# EAGLE design mapleCUx_large_067 (EAGLE 7.3.0)
MAPLE-CUx Large Version
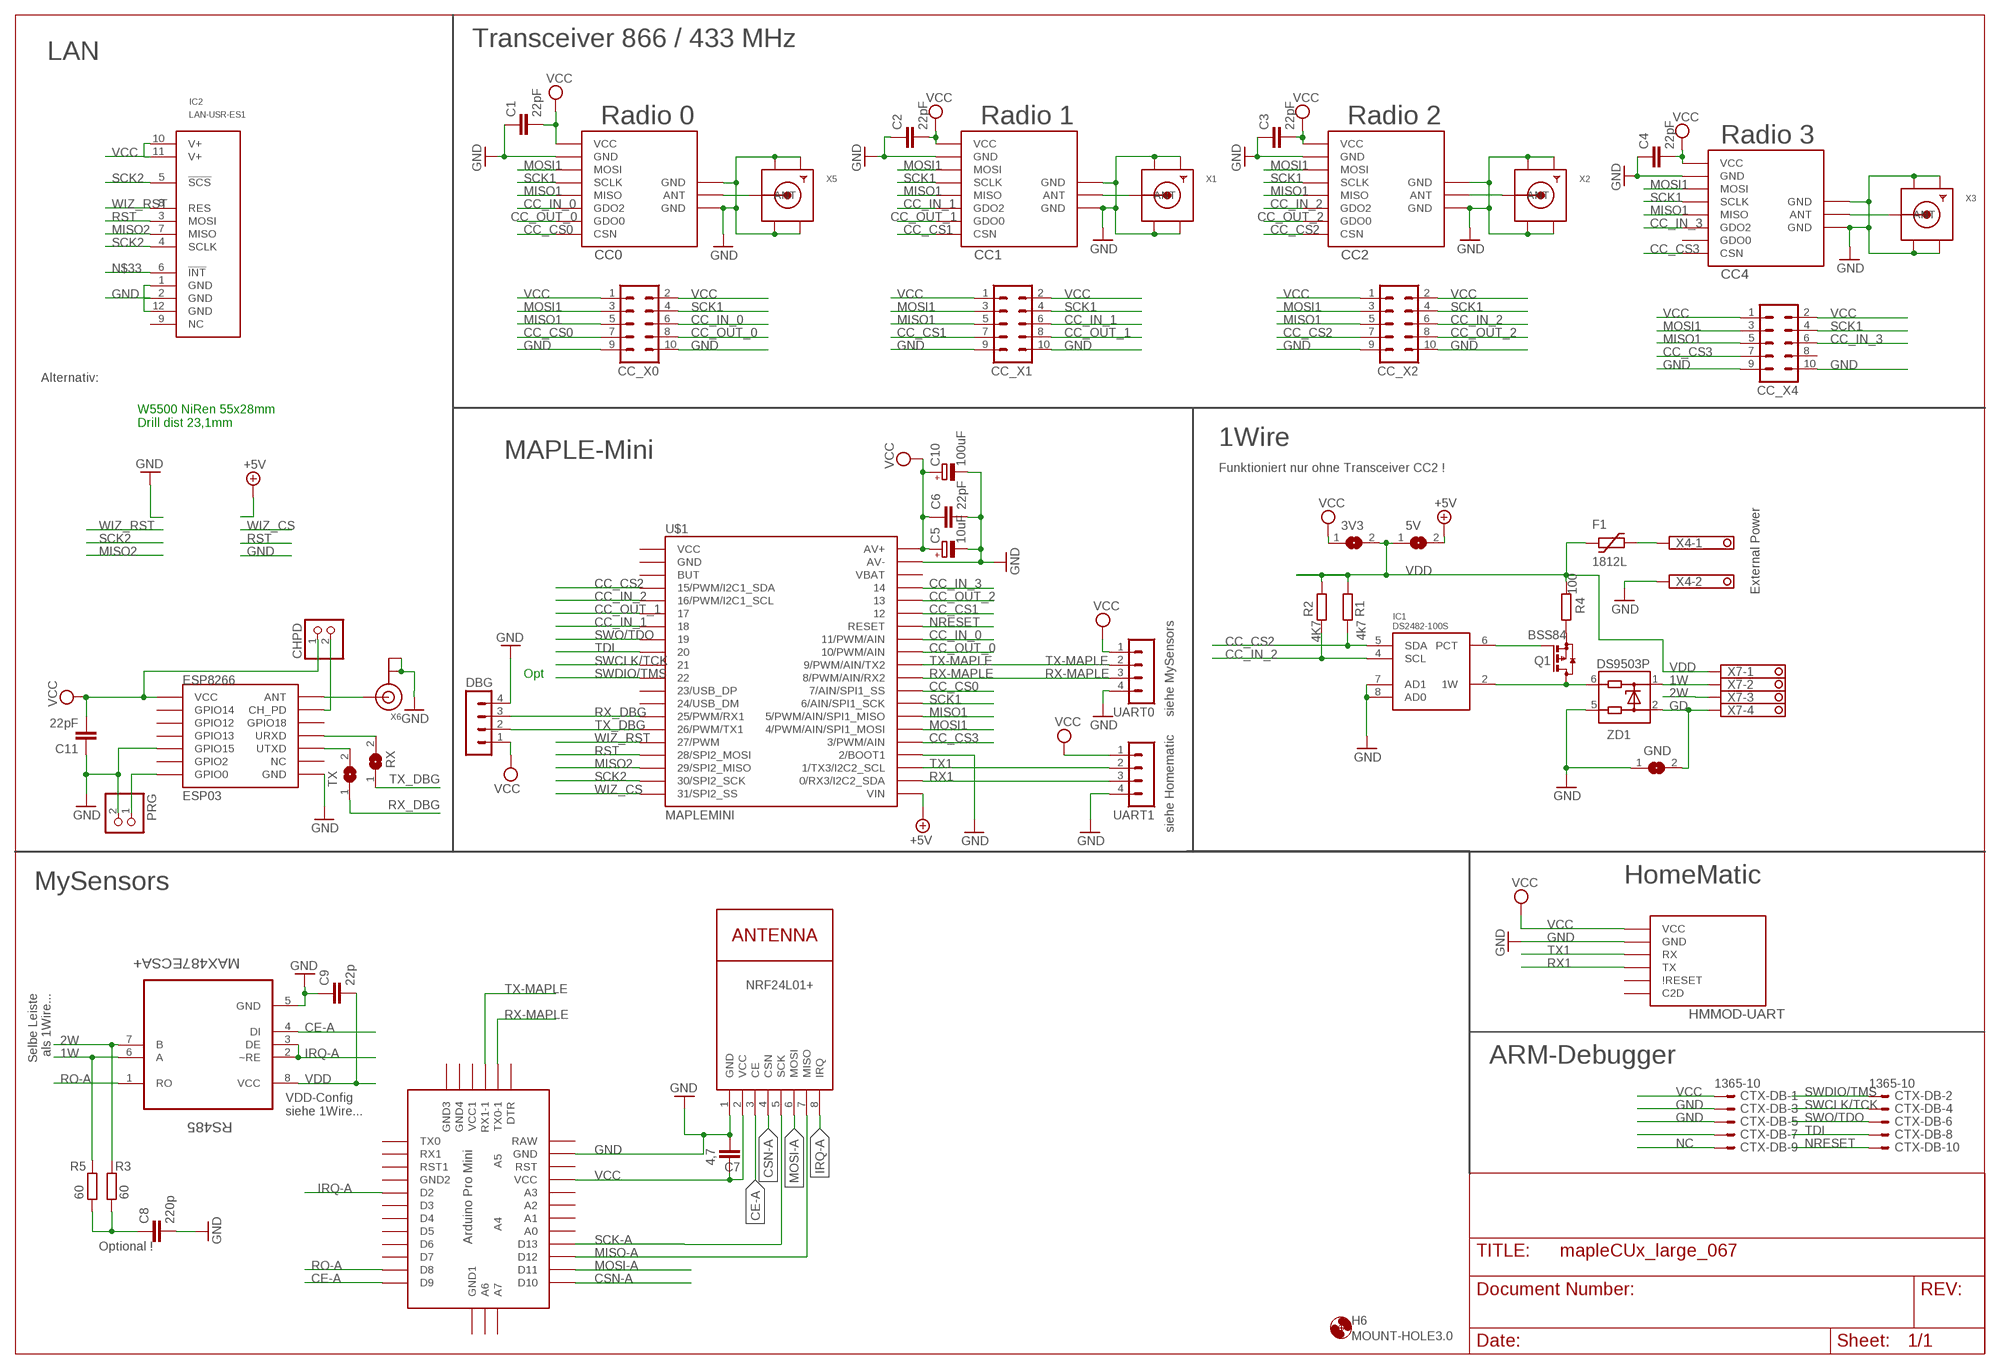
[diagram p0: schematic, sheet 1]

## Parts
3V3  SJ  [SJ]
5V  SJ  [SJ]
C1  22pF  C-EUC0805  [C0805]
C2  22pF  C-EUC0805  [C0805]
C3  22pF  C-EUC0805  [C0805]
C4  22pF  C-EUC0805  [C0805]
C5  10uF  CPOL-EUR/2012-12W  [R/2012-12W]
C6  22pF  C-EUC0805  [C0805]
C7  4,7  C-EUC1210  [C1210]
C8  220p  C-EUC0805  [C0805]
C9  22p  C-EUC0805  [C0805]
C10  100uF  CPOL-EUE5-8.5  [E5-8,5]
C11  22pF  C-EUC0805  [C0805]
CC0  CC1101  CC1101_MODULE1SMD  [CC1101_MODULE1_SMD]
CC1  CC1101_MODULE1SMD  [CC1101_MODULE1_SMD]
CC2  CC1101_MODULE1SMD  [CC1101_MODULE1_SMD]
CC4  CC1101_MODULE1SMD  [CC1101_MODULE1_SMD]
CC_X0  MA05-2  [MA05-2]
CC_X1  MA05-2  [MA05-2]
CC_X2  MA05-2  [MA05-2]
CC_X4  MA05-2  [MA05-2]
CHPD  PINHD-1X2  [1X02]
CTX-DB  1365-10  [1365-10]
DBG  MA04-1  [MA04-1]
ESP8266  ESP03  [ESP03]
F1  1812L  [1812L]
GND  SJ  [SJ]
H6  MOUNT-HOLE3.0  [3,0]
HMMOD-UART  HM-MOD-UARTDIL  [HM-MOD-UART-DIL]
IC1  DS2482-100S  [SO08]
IC2  LAN-USR-ES1  [USR-ES1]
NRF24L01+  NRF24L01+  WIRELESS-NRF24L01  [WIRELESS-NRF24L01]
PRG  PINHD-1X2  [1X02]
Q1  BSS84  [SOT23]
R1  4k7  R-EU_R0805  [R0805]
R2  4K7  R-EU_R0805  [R0805]
R3  60  R-EU_R0805  [R0805]
R4  100  R-EU_R0805  [R0805]
R5  60  R-EU_R0805  [R0805]
RS485  MAX487ECSA+  [SOIC127P600X175-8N]
RX  SJ  [SJ]
TX  SJ  [SJ]
U$1  MAPLEMINI  [20-DIP]
U$2  ABK-PRO-MINI  [ABK-PRO-MINI]
UART0  MA04-1  [MA04-1]
UART1  MA04-1  [MA04-1]
X1  SMACONNECTOR_EDGE_UFL  [SMA_EDGELAUNCH_UFL]
X2  SMACONNECTOR_EDGE_UFL  [SMA_EDGELAUNCH_UFL]
X3  SMACONNECTOR_EDGE_UFL  [SMA_EDGELAUNCH_UFL]
X4  1751248  [1751248]
X5  SMACONNECTOR_EDGE_UFL  [SMA_EDGELAUNCH_UFL]
X6  ANTENNA_U.FL  [U.FL]
X7  1751264  [1751264]
ZD1  DS9503P  [TSOC6]

## Nets
1W: R5.2 RS485.6(A) X7.2 ZD1.1
2W: R3.2 RS485.7(B) X7.3
+5V [PWR]: 5V.2 U$1.21(VIN)
CC_CS0: CC0.CSN CC_X0.7 U$1.29(7/AIN/SPI1_SS)
CC_CS1: CC1.CSN CC_X1.7 U$1.35
CC_CS2: CC2.CSN CC_X2.7 IC1.5(SDA) R1.2 U$1.4(15/PWM/I2C1_SDA)
CC_CS3: CC4.CSN CC_X4.7 U$1.25(3/PWM/AIN)
CC_IN_0: CC0.GDO2 CC_X0.6 U$1.33(11/PWM/AIN)
CC_IN_1: CC1.GDO2 CC_X1.6 U$1.7
CC_IN_2: CC2.GDO2 CC_X2.6 IC1.4(SCL) R2.2 U$1.5(16/PWM/I2C1_SCL)
CC_IN_3: CC4.GDO2 CC_X4.6 U$1.37
CC_OUT_0: CC0.GDO0 CC_X0.8 U$1.32(10/PWM/AIN)
CC_OUT_1: CC1.GDO0 CC_X1.8 U$1.6
CC_OUT_2: CC2.GDO0 CC_X2.8 U$1.36
CE-A: NRF24L01+.3(CE) RS485.4(DI) U$2.D9
CSN-A: NRF24L01+.4(CSN) U$2.D10
GD [PWR]: GND.2 X7.4 ZD1.2
GND [PWR]: C1.1 C2.1 C3.1 C4.1 C5.- C6.2 C7.1 C8.2 C9.1 C10.- C11.1 CC0.GND@0(GND) CC0.GND@1(GND) CC0.GND@2(GND) CC1.GND@0(GND) CC1.GND@1(GND) CC1.GND@2(GND) CC2.GND@0(GND) CC2.GND@1(GND) CC2.GND@2(GND) CC4.GND@0(GND) CC4.GND@1(GND) CC4.GND@2(GND) CC_X0.9 CC_X0.10 CC_X1.9 CC_X1.10 CC_X2.9 CC_X2.10 CC_X4.9 CC_X4.10 CTX-DB.3 CTX-DB.5 DBG.4 ESP8266.GND ESP8266.GPIO15 GND.1 HMMOD-UART.2(GND) IC1.7(AD1) IC1.8(AD0) IC2.1(GND) IC2.2(GND) IC2.12(GND) NRF24L01+.1(GND) PRG.2 RS485.5(GND) U$1.24(2/BOOT1) U$1.39(AV-) U$2.GND UART0.4 UART1.4 X1.GND@1(GND1) X1.GND@2(GND2) X1.GND@3(GND3) X1.GND@4(GND4) X2.GND@1(GND1) X2.GND@2(GND2) X2.GND@3(GND3) X2.GND@4(GND4) X3.GND@1(GND1) X3.GND@2(GND2) X3.GND@3(GND3) X3.GND@4(GND4) X4.2 X5.GND@1(GND1) X5.GND@2(GND2) X5.GND@3(GND3) X5.GND@4(GND4) X6.1(GND) X6.2(GND) ZD1.5
IRQ-A: NRF24L01+.8(IRQ) RS485.2(~RE) RS485.3(DE) U$2.D2
MISO1: CC0.MISO CC1.MISO CC2.MISO CC4.MISO CC_X0.5 CC_X1.5 CC_X2.5 CC_X4.5 U$1.27(5/PWM/AIN/SPI1_MISO)
MISO2: IC2.7(MISO) U$1.18(29/SPI2_MISO)
MISO-A: NRF24L01+.7(MISO) U$2.D12
MOSI1: CC0.MOSI CC1.MOSI CC2.MOSI CC4.MOSI CC_X0.3 CC_X1.3 CC_X2.3 CC_X4.3 U$1.26(4/PWM/AIN/SPI1_MOSI)
MOSI-A: NRF24L01+.6(MOSI) U$2.D11
N$1: CC1.ANT X1.P(ANT)
N$2: CC4.ANT X3.P(ANT)
N$3: CC2.ANT X2.P(ANT)
N$4: CC0.ANT X5.P(ANT)
N$8: CTX-DB.7
N$11: ESP8266.GPIO0 PRG.1
N$12: ESP8266.ANT X6.3(SIGNAL)
N$17: CHPD.2 ESP8266.CH_PD
N$18: ESP8266.URXD RX.2
N$19: ESP8266.UTXD TX.2
N$21: C8.1 R3.1 R5.1
N$33: IC2.6(!INT!)
N$45 [PWR]: F1.P$2 X4.1
N$47: IC1.6(PCT) Q1.1(G)
N$48: IC1.2(1W) Q1.3(D) ZD1.6
N$52: Q1.2(S) R4.1
NC: CTX-DB.9
NRESET: CTX-DB.10 U$1.34(RESET)
RO-A: RS485.1(RO) U$2.D8
RST: IC2.3(MOSI) U$1.17(28/SPI2_MOSI)
RX1: HMMOD-UART.5(TX) U$1.22(0/RX3/I2C2_SDA) UART1.3
RX-MAPLE: U$1.30(8/PWM/AIN/RX2) U$2.TX0-1 UART0.3
RX_DBG: DBG.3 TX.1 U$1.14(25/PWM/RX1)
SCK1: CC0.SCLK CC1.SCLK CC2.SCLK CC4.SCLK CC_X0.4 CC_X1.4 CC_X2.4 CC_X4.4 U$1.28(6/AIN/SPI1_SCK)
SCK2: IC2.4(SCLK) IC2.5(!SCS!) U$1.19(30/SPI2_SCK)
SCK-A: NRF24L01+.5(SCK) U$2.D13
SWCLK/TCK: CTX-DB.4 U$1.10
SWDIO/TMS: CTX-DB.2 U$1.11
SWO/TDO: CTX-DB.6 U$1.8
TDI: CTX-DB.8 U$1.9
TX1: HMMOD-UART.6(RX) U$1.23(1/TX3/I2C2_SCL) UART1.2
TX-MAPLE: U$1.31(9/PWM/AIN/TX2) U$2.RX1-1 UART0.2
TX_DBG: DBG.2 RX.1 U$1.15(26/PWM/TX1)
VCC [PWR]: 3V3.1 C1.2 C2.2 C3.2 C4.2 C5.+ C6.1 C7.2 C10.+ C11.2 CC0.VCC CC1.VCC CC2.VCC CC4.VCC CC_X0.1 CC_X0.2 CC_X1.1 CC_X1.2 CC_X2.1 CC_X2.2 CC_X4.1 CC_X4.2 CHPD.1 CTX-DB.1 DBG.1 ESP8266.VCC HMMOD-UART.1(VCC) IC2.10(V+) IC2.11(V+) NRF24L01+.2(VCC) U$1.40(AV+) U$2.VCC UART0.1 UART1.1
VDD [PWR]: 3V3.2 5V.1 C9.2 F1.P$1 R1.1 R2.1 R4.2 RS485.8(VCC) X7.1
WIZ_CS: U$1.20(31/SPI2_SS)
WIZ_RST: IC2.8(RES) U$1.16(27/PWM)
Unconnected: CC4.GDO0 CC_X4.8 ESP8266.GPIO2 ESP8266.GPIO12 ESP8266.GPIO13 ESP8266.GPIO14 ESP8266.GPIO18 ESP8266.NC HMMOD-UART.3(C2D) HMMOD-UART.4(\!RESET) IC2.9(NC) U$1.1(VCC) U$1.2(GND) U$1.3(BUT) U$1.12(23/USB_DP) U$1.13(24/USB_DM) U$1.38(VBAT) U$2.A0 U$2.A1 U$2.A2 U$2.A3 U$2.A4 U$2.A5 U$2.A6 U$2.A7 U$2.D3 U$2.D4 U$2.D5 U$2.D6 U$2.D7 U$2.DTR U$2.GND1(GND2) U$2.GND2(GND3) U$2.GND3(GND4) U$2.GND4(GND1) U$2.RAW U$2.RST U$2.RST1 U$2.RX1 U$2.TX0 U$2.VCC1

## Notes on the sheet
- Transceiver 866 / 433 MHz
- LAN
- Radio 0 | Radio 1 | Radio 2
- Radio 3
- Alternativ:
- W5500 NiRen 55x28mm
  Drill dist 23,1mm
- 1Wire
- MAPLE-Mini
- Funktioniert nur ohne Transceiver CC2 !
- External Power
- Opt
- siehe MySensors
- siehe Homematic
- MySensors | HomeMatic
- Selbe Leiste
  als 1Wire...
- ARM-Debugger
- VDD-Config
  siehe 1Wire...
- Optional !

## Power pins joined to a net without a drawn wire
GND: IC1.3(GND)
VDD: IC1.1(VDD)

## Library data of the parts
3V3 5V GND RX TX = jumper:SJ: SMD solder JUMPER
C1-C4 C6-C9 C11 = rcl:C-EU: CAPACITOR, European symbol
C5 C10 = rcl:CPOL-EU: POLARIZED CAPACITOR, European symbol
CC0 CC1 CC2 CC4 = wireless:CC1101_MODULE1: CC1101 wireless module for 433/868 MHz (sold from Aliexpress). DIL version for mounting with pin header (and SMD soldering) and SMD only variant available.
CC_X0 CC_X1 CC_X2 CC_X4 = con-lstb:MA05-2: PIN HEADER; OC_FARNELL: unknown; OC_NEWARK: unknown
CHPD PRG = pinhead:PINHD-1X2: PIN HEADER
CTX-DB = con-leotronics:1365-10: DUAL ROW STRAIGHT HEADER 1364 SERIES. 1.27mm x 1.27mm. Without Fixing Post. SMT Source: http://www.leotronics.co.uk/Conexcon/Data%20Sheets/sec.%20A/1364ing.pdf; OC_FARNELL: unknown; OC_NEWARK: unknown
DBG UART0 UART1 = con-lstb:MA04-1: PIN HEADER; OC_FARNELL: unknown; OC_NEWARK: unknown
ESP8266 = esp8266modules:ESP03: ESP8266 Wifi module 03; DIMENSIONS: 17.3 x 12.1 mm; PINS: 14; PITCH: 0.078" / 2 mm
F1 = ptc-littlefuse:1812L
H6 = holes:MOUNT-HOLE: MOUNTING HOLE with drill center marker
HMMOD-UART = wireless:HM-MOD-UART: eQ3 HM-MOD-UART-AW-SH2 wireless module for 868 MHz. DIL version for mounting with pin header (antenna upwards) and SMD variant available (antenna downwards).
IC1 = 1wire:DS2482-100: I2C to 1-Wire Host Adapter/Line Driver This device is a onewire host and I2C interface in one chip. It provides the complete DC/AC requirements for onewire communication, including overdrive speed mode, but, unlike the DS2480B chip, no 12V EPROM programming. Notes: For overdrive speed and 5V EEPROM programming, an external active pullup circuit must be connected to the 1W, VDD and PCT pin. See the datasheet for details. The lower two I2C adress bits of the chip can be selected by external pins, so up to 4 chips may be connected to the same I2C bus. Author: Orginal device and description from Giovanni Varasano <giovanni.varasano@fastwebnet.it> Improved by Jan Kandziora <jjj@gmx.de>
IC2 = Martin-Communication:LAN-USR-ES1
NRF24L01+ = diy-modules:WIRELESS-NRF24L01: 2.4 GHz Wireless Module based on NRF24L01 chip
Q1 = transistor-small-signal:BSS84: P-CHANNEL MOS FET
R1-R5 = rcl:R-EU_: RESISTOR, European symbol
RS485 = Maxim_By_element14_Batch_1:MAX487ECSA+: Low-Power, Slew-Rate-Limited RS-485/RS-422 Transceivers; MPN: MAX487ECSA+; OC_FARNELL: 9724532; OC_NEWARK: 68K4803; PACKAGE: SOIC-8; SUPPLIER: Maxim
U$1 = maplemini-small:MAPLEMINI
U$2 = Arduino-clone:ABK-PRO-MINI: ABK Pro-Mini Arduino Clone
X1-X3 X5 = adafruit:SMACONNECTOR: SMA Connector 90° DIP SMA Connector, 50 Ohm (4UConnector: 07259)
X4 = con-phoenix-350:1751248: MKDS 1/ 2-3,5 Printklemme Nennstrom: 10 A Bemessungsspannung: 160 V Raster: 3,5 mm Polzahl: 2 Montageart: Löten Anschlussart: Schraubanschluss Anschlussrichtung vom Leiter zur Platine: 0° Source: http://eshop.phoenixcontact.com .. 1751248.pdf; OC_FARNELL: unknown; OC_NEWARK: unknown
X6 = adafruit:ANTENNA_U.FL: U.FL Antenna Connector
X7 = con-phoenix-350:1751264: MKDS 1/ 4-3,5 Printklemme Nennstrom: 10 A Bemessungsspannung: 160 V Raster: 3,5 mm Polzahl: 4 Montageart: Löten Anschlussart: Schraubanschluss Anschlussrichtung vom Leiter zur Platine: 0° Source: http://eshop.phoenixcontact.com .. 1751264.pdf; MPN: 1751264; OC_FARNELL: unknown; OC_NEWARK: 10R0934
ZD1 = 1wire:DS9503: ESD Protection Diode with Resistors This ESD protection diode is designed especially for onewire host interfaces. Unlike the DS9502, it has two additional 5Ohm resitors in the 1W and GND line. Pin 5 and 6 have to be connected to the host side, pin 1 und 2 to the network side. The 1W line is through pin 1 and 6, the GND line is through pin 2 and 5. Author: Jan Kandziora <jjj@gmx.de>

## Net classes
0 default: width 0.305 mm
1 PWR: width 0.457 mm

## Board
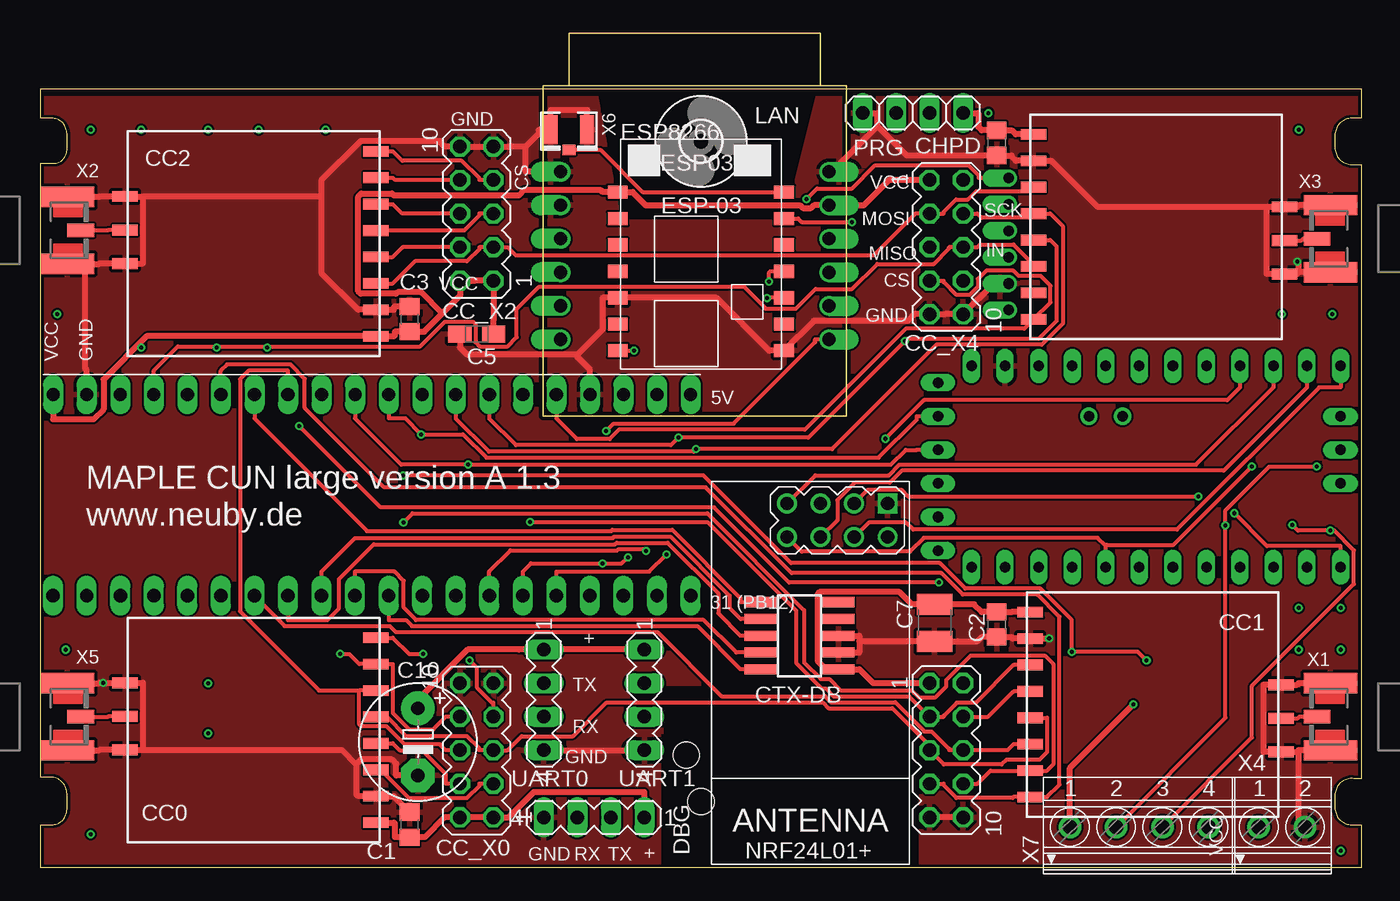
[diagram p1: board, top side]
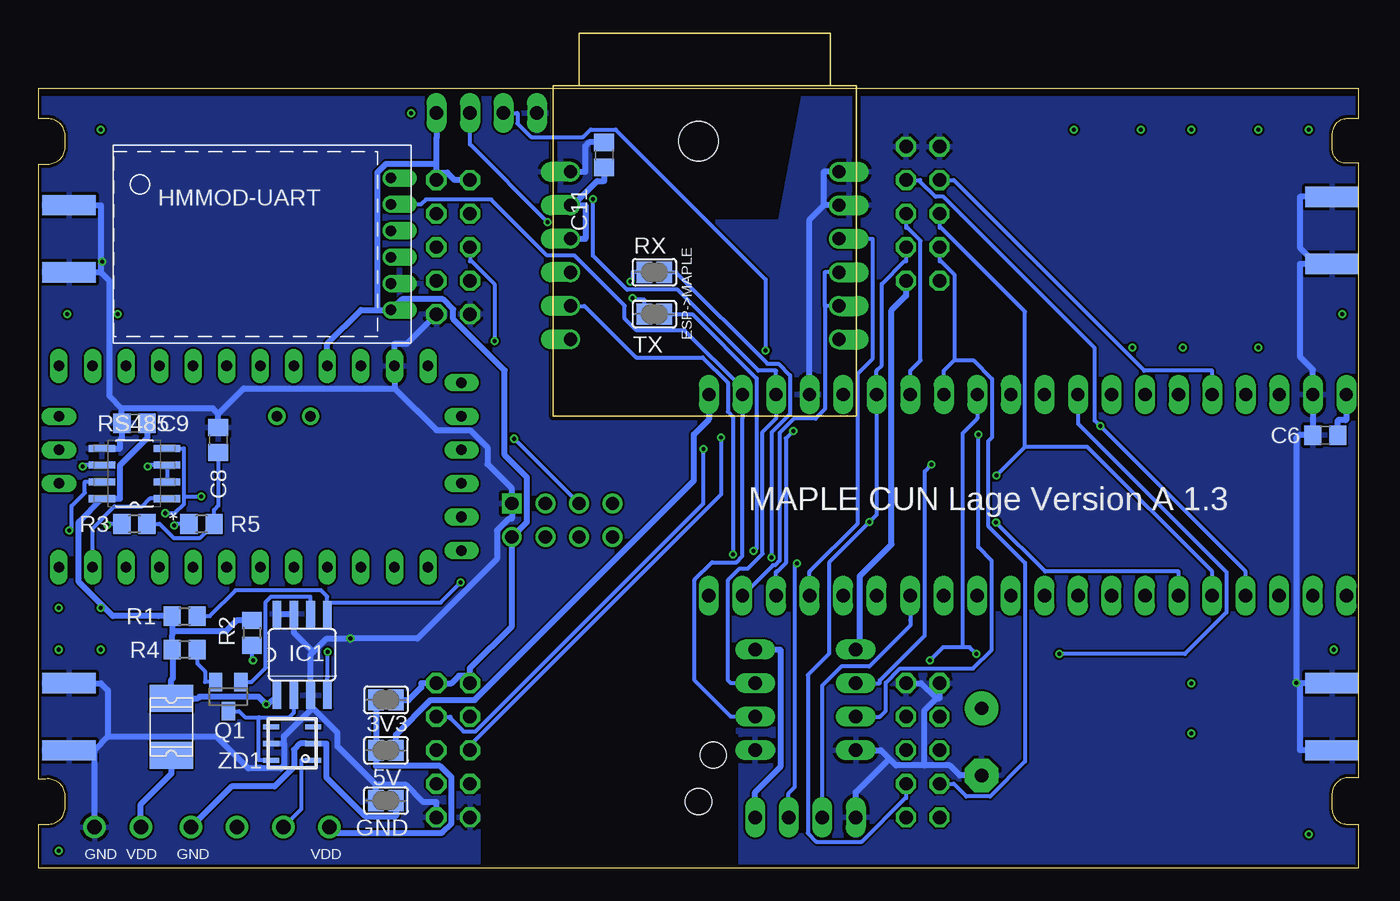
[diagram p2: board, bottom side, seen from below]

Size 100 x 59 mm. Coordinates in mm from the lower left corner, seen from the top.
Outline: 0,0 0,3.25 0.84,3.25 arc90 2,4.41 2,5.59 arc90 0.76,6.86 0,6.86 0,53.34 1.02,53.34 arc90 2,54.41 2,55.59 arc90 0.84,56.75 0,56.75 0,59 100,59 100,56.75 99.41,56.75 arc90 98,55.59 98,54.41 arc90 99.41,53.25 100,53.25 100,6.75 99.41,6.75 arc90 98,5.59 98,4.41 arc90 99.41,3.25 100,3.25 100,0 0,0
Copper layers (1*16): Top 0.035mm / dielectric 1.5mm / Bottom 0.035mm
Design rules "SeeedStudio_2layer_DRU_no_angle_20140221": minimum track width 6mil, minimum drill 12mil, track to track 6mil, track to pad 6mil, pad to pad 6mil, via to via 6mil, smd to smd 0mil, copper to edge 10mil, drill to drill 10mil, minimum pad ring 10mil, minimum via ring 6mil, stop-mask expansion 2mil, vias tented up to drill 100mil, thermal gap 10mil
Holes 2 mm at 48.9,8.53 50,5
tRestrict: area 0,58.6 to 100,59; area 47,-1.9 to 66,10.1
bRestrict: area 0,58.6 to 100,59; area 0,58.6 to 100,59; area 47,-1.9 to 66,10.1

### Footprints (pad centres in the part's own frame; a part is rotated, then mirrored left to right if it is on the bottom)
SJ = smd 1.168 x 1.6: 1 -0.762,0; 2 0.762,0
C0805 = smd 1.3 x 1.5: 1 -0.95,0; 2 0.95,0
R/2012-12W = smd 1.75 x 1.26: + 1.275,0; - -1.275,0
C1210 = smd 1.6 x 2.7: 1 -1.4,0; 2 1.4,0
E5-8,5 = drill 1.016 pad 2.54: + -2.54,0 | drill 1.016 pad 2.54 octagon: - 2.54,0
CC1101_MODULE1_SMD = smd 1.93 x 0.813: ANT 19,5.96; CSN 0,0; GDO0 0,2; GDO2 0,4; GND@0 0,12; GND@1 19,8.5; GND@2 19,3.42; MISO 0,6; MOSI 0,10; SCLK 0,8; VCC 0,14
MA05-2 = drill 1.016 octagon: 1 -5.08,-1.27; 2 -5.08,1.27; 3 -2.54,-1.27; 4 -2.54,1.27; 5 0,-1.27; 6 0,1.27; 7 2.54,-1.27; 8 2.54,1.27; 9 5.08,-1.27; 10 5.08,1.27
1X02 = drill 1.016 long: 1 -1.27,0; 2 1.27,0
1365-10 = smd 0.76 x 2.4: 1 -2.54,-2.95; 2 -2.54,2.95; 3 -1.27,-2.95; 4 -1.27,2.95; 5 0,-2.95; 6 0,2.95; 7 1.27,-2.95; 8 1.27,2.95; 9 2.54,-2.95; 10 2.54,2.95
MA04-1 = drill 1.016 long: 1 -3.81,0; 2 -1.27,0; 3 1.27,0; 4 3.81,0
ESP03 = smd 1.5 x 1: ANT 7.4,4.8; CH_PD 7.4,2.8; GND 7.4,-7.2; GPIO0 -5.2,-7.2; GPIO2 -5.2,-5.2; GPIO12 -5.2,0.8; GPIO13 -5.2,-1.2; GPIO14 -5.2,2.8; GPIO15 -5.2,-3.2; GPIO18 7.4,0.8; NC 7.4,-5.2; URXD 7.4,-1.2; UTXD 7.4,-3.2; VCC -5.2,4.8
1812L = smd 2.03 x 3.3: P$1 -2.16,0; P$2 2.16,0
3,0 = hole 3: 0,0
HM-MOD-UART-DIL = drill 0.8 offset: 1 0,12; 2 0,10; 3 0,8; 4 0,6; 5 0,4; 6 0,2
SO08 = smd 0.66 x 2.032: 1 -1.905,-3.073; 2 -0.635,-3.073; 3 0.635,-3.073; 4 1.905,-3.073; 5 1.905,3.073; 6 0.635,3.073; 7 -0.635,3.073; 8 -1.905,3.073
USR-ES1 = drill 1 pad 1.35 offset: 1 -10.16,5.715; 2 -10.16,3.175; 3 -10.16,0.635; 4 -10.16,-1.905; 5 -10.16,-4.445; 6 -10.16,-6.985; 7 10.16,-6.985; 8 10.16,-4.445; 9 10.16,-1.905; 10 10.16,0.635; 11 10.16,3.175; 12 10.16,5.715
WIRELESS-NRF24L01 = drill 1 square: 1 -12.7,6.35 | drill 1: 2 -10.16,6.35; 3 -12.7,3.81; 4 -10.16,3.81; 5 -12.7,1.27; 6 -10.16,1.27; 7 -12.7,-1.27; 8 -10.16,-1.27
SOT23 = smd 1 x 1.4: 1 -0.95,-1.1; 2 0.95,-1.1; 3 0,1.1
R0805 = smd 1.3 x 1.5: 1 -0.95,0; 2 0.95,0
SOIC127P600X175-8N = smd 1.981 x 0.533: 1 -2.464,1.905; 2 -2.464,0.635; 3 -2.464,-0.635; 4 -2.464,-1.905; 5 2.464,-1.905; 6 2.464,-0.635; 7 2.464,0.635; 8 2.464,1.905
20-DIP = drill 1.016 pad 1.27 long: 1 -24.13,-7.62; 2 -21.59,-7.62; 3 -19.05,-7.62; 4 -16.51,-7.62; 5 -13.97,-7.62; 6 -11.43,-7.62; 7 -8.89,-7.62; 8 -6.35,-7.62; 9 -3.81,-7.62; 10 -1.27,-7.62; 11 1.27,-7.62; 12 3.81,-7.62; 13 6.35,-7.62; 14 8.89,-7.62; 15 11.43,-7.62; 16 13.97,-7.62; 17 16.51,-7.62; 18 19.05,-7.62; 19 21.59,-7.62; 20 24.13,-7.62 | drill 1 pad 1.27 long: 21 24.13,7.62; 22 21.59,7.62; 23 19.05,7.62; 24 16.51,7.62; 25 13.97,7.62; 26 11.43,7.62; 27 8.89,7.62; 28 6.35,7.62; 29 3.81,7.62; 30 1.27,7.62; 31 -1.27,7.62; 32 -3.81,7.62; 33 -6.35,7.62; 34 -8.89,7.62; 35 -11.43,7.62; 36 -13.97,7.62; 37 -16.51,7.62; 38 -19.05,7.62; 39 -21.59,7.62; 40 -24.13,7.62
ABK-PRO-MINI = drill 0.8 long: A0 10.16,-3.81; A1 10.16,-6.35; A2 10.16,-8.89; A3 10.16,-11.43; A6 3.81,-21.59; A7 6.35,-21.59; D2 -5.08,-3.81; D3 -5.08,-6.35; D4 -5.08,-8.89; D5 -5.08,-11.43; D6 -5.08,-13.97; D7 -5.08,-16.51; D8 -5.08,-19.05; D9 -5.08,-21.59; D10 10.16,-21.59; D11 10.16,-19.05; D12 10.16,-16.51; D13 10.16,-13.97; DTR 8.89,8.89; GND 10.16,3.81; GND1 -5.08,-1.27; GND2 -3.81,8.89; GND3 -1.27,8.89; GND4 1.27,-21.59; RAW 10.16,6.35; RST 10.16,1.27; RST1 -5.08,1.27; RX1 -5.08,3.81; RX1-1 3.81,8.89; TX0 -5.08,6.35; TX0-1 6.35,8.89; VCC 10.16,-1.27; VCC1 1.27,8.89 | drill 0.8: A4 6.35,-5.08; A5 6.35,-2.54
SMA_EDGELAUNCH_UFL = smd 4.064 x 1.524: GND@1 2.032,-2.54; GND@2 2.032,2.54 | smd 4.064 x 1.524 bottom: GND@3 2.032,2.54; GND@4 2.032,-2.54 | smd 2.032 x 1.016: P 3.048,0
1751248 = drill 1.1 pad 1.7: 1 -1.75,-0.1; 2 1.75,-0.1
U.FL = smd 2.2 x 1.05: 1 0,1.375; 2 0,-1.375 | smd 0.8 x 1: 3 1.525,0
1751264 = drill 1.1 pad 1.7: 1 -5.25,-0.1; 2 -1.75,-0.1; 3 1.75,-0.1; 4 5.25,-0.1
TSOC6 = smd 0.406 x 1.219: 1 -1.27,-1.6; 2 0,-1.6; 3 1.27,-1.6; 4 1.27,1.6; 5 0,1.6; 6 -1.27,1.6

### Placement (x,y rotation side)
3V3  73.66,12.7 180 bottom
5V  73.66,8.89 0 bottom
C1  27.94,3.25 270 top
C2  72.39,18.41 90 top
C3  27.94,41.55 270 top
C4  72.39,54.88 90 top
C5  33.02,40.4 0 top
C6  2.54,32.75 180 bottom
C7  67.69,18.54 90 top
C8  86.36,32.38 90 bottom
C9  92.71,33.66 0 bottom
C10  28.57,9.53 270 top
C11  57.15,53.98 270 bottom
CC0  25.4,17.41 180 top
CC1  74.93,5.35 0 top
CC2  25.4,54.24 180 top
CC4  75.18,41.53 0 top
CC_X0  33.02,8.89 90 top
CC_X1  68.58,8.89 270 top
CC_X2  33.02,49.53 90 top
CC_X4  68.58,46.99 270 top
CHPD  68.58,57.15 180 top
CTX-DB  57.46,17.56 90 top
DBG  41.91,3.81 180 top
ESP8266  48.9,46.35 0 top
F1  89.92,10.67 270 bottom
GND  73.66,5.08 0 bottom
H6  50,55 0 top
HMMOD-UART  73.28,54.23 180 bottom
IC1  80.01,16.13 0 bottom
IC2  49.53,46.99 0 top
NRF24L01+  57.78,14.88 270 top
PRG  63.5,57.15 180 top
Q1  85.6,12.95 180 bottom
R1  88.9,19.05 0 bottom
R2  83.82,17.78 270 bottom
R3  92.71,26.04 180 bottom
R4  88.9,16.51 180 bottom
R5  87.63,26.04 180 bottom
RS485  92.71,29.84 180 bottom
RX  53.34,45.09 180 bottom
TX  53.34,41.91 180 bottom
U$1  25.08,28.21 0 top
U$2  76.83,27.83 90 top
UART0  38.1,12.7 270 top
UART1  45.72,12.7 270 top
X1  99.69,11.43 180 top
X2  0,48.26 0 top
X3  99.69,47.62 180 top
X4  93.98,3.17 0 top
X5  0,11.43 0 top
X6  40.01,55.88 270 top
X7  83.19,3.17 0 top
ZD1  80.77,9.4 90 bottom

### Tracks (layer width: path | path; a pad name or v marks a point on that pad's centre or on a via)
1W  (via drill 0.3 pad 0.61)
  Top 0.305: v96.62,30.37 93.02,30.37 89.71,27.06 v89.71,25.91 89.71,11.35 X7.2
  Bottom 0.305: RS485.6 96.47,30.48 96.58,30.37 v96.62,30.37 | v89.71,25.91 89.66,25.91 89.53,26.04 R5.2 | X7.2 80.09,4.42 80.09,8.13 ZD1.1
2W  (via drill 0.3 pad 0.61)
  Top 0.305: X7.3 91.71,9.85 91.71,13.76 99.44,21.48 99.44,24.03 97.94,25.53 v97.64,25.53 95.19,25.53 v94.78,25.94
  Bottom 0.305: v97.64,25.53 97.46,25.53 97.46,27.4 96.47,28.38 96.47,29.21 RS485.7 | R3.2 94.61,26.04 94.71,25.94 v94.78,25.94
+5V
  Bottom 0.457: 5V.2 72.9,10.07 70.27,12.7 66.95,12.7 50.35,29.31 50.35,32.81 49.21,33.94 U$1.21
CC_CS0  (via drill 0.3 pad 0.61)
  Top 0.305: CC_X0.7 34.29,12.5 34.18,12.5 33.02,13.66 33.02,15.15 v32.49,15.69 | v28.98,16.18 27.91,16.18 26.67,17.41 CC0.CSN
  Bottom 0.305: 30,16.69 31.48,16.69 v32.49,15.69 | v28.98,16.18 29.49,16.69 30,16.69 | 30,16.69 30,32.91 28.89,34.02 U$1.29
CC_CS1
  Top 0.305: U$1.35 13.65,37.64 14.11,38.1 18.92,38.1 20,37.02 20,34.82 26.02,28.8 50.36,28.8 56.85,22.3 68.2,22.3 69.83,20.68 75.45,20.68 77.14,18.99 77.14,6.29 76.2,5.35 CC1.CSN 74.73,5.35 73.66,5.35 73.59,5.28 69.33,5.28 68.38,6.24 68.38,6.35 CC_X1.7
CC_CS2  (via drill 0.3 pad 0.61)
  Top 0.305: v68.01,21.59 56.68,21.59 50.99,27.29 25.75,27.29 v19.59,33.44 | CC2.CSN 26.67,54.24 27.38,53.53 31.89,53.53 33.22,52.2 33.22,52.07 CC_X2.7
  Bottom 0.305: 78.11,20.08 69.52,20.08 v68.01,21.59 | 78.11,20.08 78.11,20.52 78.58,21 85.05,21 87,19.05 R1.2 | IC1.5 78.11,20.08 | CC_X2.7 33.22,52.07 33.22,51.96 32.06,50.8 31.45,50.8 20,39.35 20,33.85 v19.59,33.44 8.57,22.42 U$1.4
CC_CS3
  Top 0.305: CC_X4.7 68.38,44.45 68.38,44.34 69.36,43.36 70.33,43.36 70.96,43.99 70.96,44.58 71.59,45.21 73.65,45.21 74.06,44.81 75.72,44.81 76.45,44.08 76.45,42.8 CC4.CSN 74.47,40.82 65.52,40.82 57.86,33.17 43.79,33.17 43.08,32.46 40.61,32.46 39.05,34.02 U$1.25
CC_IN_0
  Top 0.305: U$1.33 18.73,37.64 15.75,37.64 15.09,36.99 15.09,19.41 21.09,13.41 24.13,13.41 | 24.13,13.41 24.13,10.85 24.29,10.69 26.21,10.69 27.55,9.35 30.23,9.35 30.68,8.89 CC_X0.6 | CC0.GDO2 24.13,13.41
CC_IN_1
  Top 0.305: U$1.7 18.48,18.3 26.43,18.3 26.89,17.85 46.7,17.85 51.56,12.98 59.4,12.98 59.86,12.52 64.71,12.52 66.91,10.32 67.46,10.32 68.78,9 68.78,8.89 CC_X1.6 73.2,8.89 73.66,9.35 CC1.GDO2
CC_IN_2  (via drill 0.3 pad 0.61)
  Top 0.305: v27.45,29.7 50.18,29.7 56.82,23.06 68.09,23.06 70.02,21.14 75.7,21.14 78.07,18.76 v78.07,16.35 83.08,16.35 v83.74,15.69 | CC2.GDO2 26.67,50.24 27.39,49.53 CC_X2.6
  Bottom 0.305: 25.28,31.87 v27.45,29.7 | 25.28,31.87 20.57,31.87 11.11,22.42 U$1.5 | 25.28,31.87 25.28,42.1 31.64,48.46 31.75,48.46 CC_X2.6 | v78.07,16.35 78.07,14.41 78.11,14.38 IC1.4 | R2.2 83.82,15.88 83.74,15.79 v83.74,15.69
CC_IN_3
  Top 0.305: U$1.37 8.57,37.64 10.4,39.47 28.75,39.47 30.62,41.34 32.75,41.34 32.92,41.16 32.92,39.78 33.24,39.47 35.36,39.47 36.06,40.16 36.06,42.3 37.75,44 53.26,44 54.92,42.34 57.19,42.34 58.67,43.81 61.45,43.81 63.35,45.72 67.62,45.72 68.78,46.88 68.78,46.99 CC_X4.6 70.92,46.99 71.13,47.2 73.67,47.2 75.18,45.68 CC4.GDO2
CC_OUT_0  (via drill 0.3 pad 0.61)
  Top 0.305: v22.67,16.18 23.36,16.18 24.13,15.41 CC0.GDO0 26.67,15.41 26.67,11.72 27.92,10.47 29.72,10.47 30.68,11.43 CC_X0.8
  Bottom 0.305: U$1.32 21.27,33.62 10.03,22.38 10.03,19.32 13.17,16.18 v22.67,16.18
CC_OUT_1  (via drill 0.3 pad 0.61)
  Top 0.305: v27.47,26.13 28.16,26.83 50.48,26.83 57.81,19.49 57.81,15.54 59.07,14.28 59.72,14.28 60.56,13.44 65.95,13.44 66.49,12.9 67.76,12.9 68.58,13.72 68.58,14.22 70.43,16.06 76.02,16.06 76.67,15.41 76.67,7.82 76.2,7.35 CC1.GDO0 71.92,7.35 70.92,6.35 CC_X1.8
  Bottom 0.305: v27.47,26.13 23.76,22.42 13.65,22.42 U$1.6
CC_OUT_2
  Top 0.305: CC2.GDO0 26.67,52.24 26.84,52.07 CC_X2.8
  Bottom 0.305: CC_X2.8 30.68,52.07 16.26,37.64 11.11,37.64 U$1.36
CE-A  (via drill 0.3 pad 0.61)
  Top 0.305: NRF24L01+.3 62.65,28.63 65.17,28.63 65.68,28.12 v87.64,28.12 | U$2.D9 98.42,24.36 92.84,24.36 v90.36,26.84
  Bottom 0.305: 88.95,28.12 88.95,31.75 RS485.4 | v90.36,26.84 89.64,26.84 88.95,27.53 88.95,28.12 | 88.95,28.12 v87.64,28.12
CSN-A
  Top 0.305: NRF24L01+.4 62.7,26.14 65.52,26.14 66.07,25.6 86.03,25.6 96.81,36.38 98.42,36.38 U$2.D10
GD
  Bottom 0.457: GND.2 72.9,3.9 75.23,3.9 78.18,6.85 78.18,9.4 ZD1.2 79.67,9.4 80.16,9.4 80.62,8.94 80.62,7.64 82.1,6.16 85.35,6.16 X7.4
GND  (via drill 0.3 pad 0.61)
  Top 0.457: 63.37,56.15 63.37,57.15 PRG.2 | 63.37,56.15 65.59,53.93 C4.1 72.56,53.93 73.52,53.93 73.52,53.85 73.84,53.53 CC4.GND@0 76.53,53.53 80.03,50.03 92.84,50.03 | 63.37,56.15 59.93,52.7 IC2.12 | C10.- 26.92,6.99 26.92,7.88 26.6,8.2 24.27,8.2 23.9,7.84 | 23.9,7.84 23.9,5.57 24.05,5.42 CC0.GND@0 26.75,5.42 26.75,5.4 C1.1 | 7.75,8.91 22.82,8.91 23.9,7.84 | 7.75,8.91 7.75,13.99 CC0.GND@2 v4.75,13.99 4.47,13.99 4.45,13.97 X5.GND@2 | 95.25,45.09 95.25,45.8 v95.14,45.9 | HMMOD-UART.2 72.17,44.23 CC_X4.10 68.45,41.91 CC_X4.9 66.17,41.91 65.67,41.41 58.55,41.41 ESP8266.GND 55.16,39.16 51.16,43.16 ESP8266.GPIO15 42.56,43.16 42.56,40.76 40.65,38.84 | C3.1 26.81,42.49 26.75,42.43 26.75,42.24 CC2.GND@0 24.05,42.24 21.26,45.04 21.26,50.83 | v76.36,17.35 76.28,17.35 CC1.GND@0 73.58,17.35 73.58,17.4 73.52,17.46 C2.1 71.26,17.46 70.94,17.14 69.42,17.14 C7.1 65.96,17.14 61.99,17.14 | 40.65,38.84 40.65,38.66 41.59,37.72 U$1.24 | 40.65,38.84 32.29,38.84 31.75,39.39 C5.- | CC_X1.10 CC_X1.9 | 7.75,50.83 7.75,45.74 CC2.GND@1 4.47,45.74 4.45,45.72 3.38,45.72 | 21.26,50.83 7.75,50.83 | U$1.39 3.49,37.72 3.38,37.83 3.38,45.72 | X2.GND@4 3.38,45.72 | 95.25,8.77 95.25,8.89 X1.GND@2 | 95.25,8.77 CC1.GND@2 92.58,8.77 92.58,13.85 CC1.GND@1 95.13,13.85 95.25,13.97 X1.GND@1 | X4.2 95.25,3.56 95.25,8.77 | 21.26,50.83 21.26,52.06 24.23,55.03 30.18,55.03 30.61,54.61 CC_X2.10 CC_X2.9 35.43,54.61 36.73,54.61 | 7.75,50.83 CC2.GND@2 4.47,50.83 4.45,50.8 X2.GND@2 | 92.84,50.03 92.84,44.95 CC4.GND@2 95.11,44.95 95.25,45.09 | 92.84,50.03 CC4.GND@1 95.11,50.03 95.25,50.16 X3.GND@1 | 7.75,8.91 CC0.GND@1 4.47,8.91 4.45,8.89 X5.GND@1
  Top 0.457: X3.GND@2 95.25,45.09 | CTX-DB.5 61.99,17.56 61.99,17.14 | 61.99,17.14 61.99,16.29 CTX-DB.3 | UART0.4 UART1.4 | 36.73,54.61 37.72,55.61 37.72,55.88 X6.2 38.63,57.36 41.38,57.36 X6.1 | 36.73,54.61 36.73,52.7 IC2.1
  Bottom 0.457: X2.GND@2 4.45,50.8 4.45,46.93 3.24,45.72 | 3.24,45.72 4.45,45.72 4.45,38.67 3.49,37.72 U$1.39 3.49,35.52 3.49,33.94 C6.2 4.52,32.75 4.75,32.52 v4.75,13.99 4.45,13.69 | X2.GND@4 3.24,45.72 | 73.03,36.3 69.85,33.12 67.3,33.12 65.99,31.81 65.99,30.56 64.14,28.71 NRF24L01+.1 64.14,26.44 64.35,26.44 65.27,25.52 65.27,23.36 71.28,17.35 v76.36,17.35 78.14,17.35 79.16,16.32 | 73.03,36.3 U$2.GND 73.03,39.68 72.08,39.68 CC_X4.10 | 86.36,34.37 84.43,36.3 73.03,36.3 | C11.1 58.28,54.92 58.55,54.65 58.55,52.7 IC2.12 | 95.25,45.9 95.25,45.09 | 95.25,45.9 95.25,50.16 X3.GND@1 | 95.25,45.9 v95.14,45.9 | 95.25,45.09 94.61,44.45 94.61,35.74 93.66,34.79 | 93.66,34.79 C9.1 93.66,32.52 93.8,32.38 93.8,31.75 RS485.5 | C8.2 86.36,34.37 | 86.36,34.37 86.78,34.79 93.66,34.79 | 79.16,16.32 80.64,17.8 IC1.7 IC1.8 | 79.16,16.32 79.38,16.11 79.38,14.45 IC1.3 79.38,11.95 | 74.42,6.26 77.34,9.18 77.34,10.21 79.08,11.95 79.38,11.95 | 32,12.82 31.99,12.83 31.75,12.83 CC_X0.10 | 32.9,7.74 32.9,11.92 32,12.82 | 32,12.82 33.15,13.97 CC_X0.9 | 32.9,7.74 35.05,7.74 35.56,8.26 | 32.9,7.74 30.98,7.74 30.23,6.99 C10.- | 35.56,8.26 36.2,8.89 UART0.4 | 35.56,8.26 38.1,5.71 DBG.4 | 94.72,9.9 95.73,8.89 | 94.72,9.9 94.72,13.44 95.25,13.97 X1.GND@1 | 81.38,9.4 81.38,7.75 81.61,7.51 84.09,7.51 86.48,9.9 94.72,9.9 | 81.38,9.4 81.53,9.4 ZD1.5 | 81.38,9.4 81.38,9.95 79.38,11.95 | X1.GND@2 95.73,8.89 | X4.2 95.73,8.89 | 4.45,13.69 4.45,13.97 X5.GND@2 | 4.45,13.69 4.45,8.89 X5.GND@1 | GND.1 74.42,6.26 | CC_X1.10 69.85,4.95 70.84,4.95 72.15,6.26 74.42,6.26 | U$1.24 41.59,49.08 40.51,50.16 | IC2.1 40.51,52.7 40.51,50.16 | IC2.2 40.51,50.16
  Bottom 0.457: X3.GND@2 95.25,45.09
  pour Bottom: 0,59 0.1,0 46.99,0 46.99,13.97 66.67,13.97 66.67,0 100,0 100,59 59.05,59.05 56.52,48.9 43.81,48.9 41.91,59.05
  pour Top: 0.13,0 0,59 41.91,59.05 43.81,48.9 56.52,48.9 59.05,59.05 100,59 100,0 66.67,0 66.67,13.97 46.99,13.97 46.99,0
IRQ-A  (via drill 0.3 pad 0.61)
  Top 0.305: 80.64,24.36 80.72,24.44 85.77,24.44 v91.7,30.38 | 80.64,24.36 80.02,24.98 66.88,24.98 65.83,23.93 57.62,23.93 NRF24L01+.8 | 80.64,24.36 80.64,24.25 U$2.D2
  Bottom 0.305: v91.7,30.38 91.6,30.48 91.54,30.48 RS485.3 RS485.2
MISO1  (via drill 0.3 pad 0.61)
  Top 0.305: CC1.MISO 76.2,11.35 76.2,8.75 75.62,8.17 73.13,8.17 72.76,7.81 68.39,7.81 CC_X1.5 67.31,9.24 64.49,12.06 59.67,12.06 59.22,12.51 42.86,12.51 40.31,9.96 36.42,9.96 35.36,8.89 CC_X0.5 33.76,8.89 33.22,8.89 33.22,9.02 32.29,9.96 27.68,9.96 26.23,11.41 CC0.MISO | CC4.MISO 76.45,47.53 76.94,47.05 76.94,41.42 75.58,40.06 65.63,40.06 v65.45,39.87 58.13,32.56 v48.29,32.56 47.73,32 35.99,32 33.97,34.02 U$1.27 | CC_X2.5 33.22,49.53 33.22,49.4 32.07,48.24 CC2.MISO
  Bottom 0.305: v48.29,32.56 48.29,28.27 67.31,9.24 CC_X1.5 | CC_X4.5 67.31,45.92 67.18,45.92 65.45,44.2 v65.45,39.87 | CC_X2.5 34.29,48.46 34.18,48.46 33.2,47.48 33.2,38.42 33.97,37.64 U$1.27
MISO2  (via drill 0.3 pad 0.61)
  Top 0.305: IC2.7 58.63,40.01 58.63,39.79 52.47,33.63 43.39,33.63 v42.83,33.07
  Bottom 0.305: v42.83,33.07 43.4,32.5 43.4,23.06 44.03,22.42 44.13,22.42 U$1.18
MISO-A
  Top 0.305: NRF24L01+.7 58.65,29.71 64.22,29.71 65.02,30.52 87.48,30.52 93.34,36.38 U$2.D12
MOSI1  (via drill 0.3 pad 0.61)
  Top 0.305: v37.06,26.17 50.49,26.17 57.19,19.47 57.19,15.51 59.13,13.57 59.45,13.57 60.05,12.98 65.76,12.98 CC_X1.3 68.38,11.43 68.38,11.5 69.38,12.5 70.81,12.5 73.66,15.35 CC1.MOSI | CC2.MOSI 26.67,44.24 28.35,45.92 32.29,45.92 33.22,46.86 33.22,46.99 CC_X2.3 35.36,46.99 36,46.35 63.06,46.35 66.24,49.53 CC_X4.3 67.84,49.53 68.38,49.53 68.38,49.66 69.31,50.6 70.2,50.6 70.84,51.23 74.88,51.23 CC4.MOSI | CC_X0.3 33.22,6.35 33.22,6.22 32.27,5.26 27.9,5.26 25.74,7.42 CC0.MOSI
  Bottom 0.305: CC_X2.3 34.29,45.92 34.4,45.92 36.13,44.2 36.13,38.03 36.51,37.64 U$1.26 36.51,26.72 v37.06,26.17 40.12,23.11 40.12,16.2 41.73,14.59 41.73,2.61 41.09,1.97 37.64,1.97 34.33,5.28 34.29,5.28 CC_X0.3
MOSI-A
  Top 0.305: NRF24L01+.6 60.33,26.3 60.33,27.83 61.64,29.15 64.3,29.15 65.21,30.06 89.57,30.06 95.89,36.38 U$2.D11
N$1
  Top 0.305: CC1.ANT 95.2,11.31 95.32,11.43 X1.P
N$2
  Top 0.305: CC4.ANT 95.45,47.49 95.59,47.62 X3.P
N$3
  Top 0.305: CC2.ANT 5.13,48.28 5.11,48.26 X2.P
N$4
  Top 0.305: CC0.ANT 5.13,11.46 5.11,11.43 X5.P
N$6  (via drill 0.3 pad 0.61)
  other vias: 3.81,55.88
N$7  (via drill 0.3 pad 0.61)
  other vias: 1.27,41.91
N$9  (via drill 0.3 pad 0.61)
  other vias: 3.81,2.54
N$10  (via drill 0.3 pad 0.61)
  other vias: 1.91,16.51
N$11  (via drill 0.3 pad 0.61)
  Top 0.305: v44.92,39.16 44.75,39.16 ESP8266.GPIO0
  Bottom 0.305: v44.92,39.16 44.92,44.54 56.27,55.9 58.17,55.9 58.75,55.32 62.67,55.32 63.7,56.35 63.7,57.15 PRG.1
N$12
  Top 0.305: X6.3 42.38,54.35 45.58,51.16 ESP8266.ANT
N$13  (via drill 0.3 pad 0.61)
  other vias: 7.62,55.88
N$14  (via drill 0.3 pad 0.61)
  other vias: 12.7,55.88
N$16  (via drill 0.3 pad 0.61)
  other vias: 95.25,55.88
N$17  (via drill 0.3 pad 0.61)
  Top 0.305: v61.44,48.9 57.61,48.9 57.35,49.16 ESP8266.CH_PD
  Bottom 0.305: v61.44,48.9 67.31,54.77 CHPD.2
N$18  (via drill 0.3 pad 0.61)
  Top 0.305: v55.16,44.38 55.16,45.08 55.24,45.16 ESP8266.URXD
  Bottom 0.305: RX.2 54.99,45.09 54.99,44.55 v55.16,44.38
N$19  (via drill 0.3 pad 0.61)
  Top 0.305: ESP8266.UTXD 55.24,43.16 55.21,43.13 v54.99,43.13
  Bottom 0.305: TX.2 54.1,43.02 54.88,43.02 v54.99,43.13
N$21
  Bottom 0.305: C8.1 86.36,30.48 86.36,27.41 86.68,27.09 R5.1 87.78,24.93 89.7,24.93 90.81,26.04 R3.1
N$22  (via drill 0.3 pad 0.61)
  other vias: 7.62,39.37
N$23  (via drill 0.3 pad 0.61)
  other vias: 13.34,39.37
N$25  (via drill 0.3 pad 0.61)
  other vias: 17.14,39.37
N$28  (via drill 0.3 pad 0.61)
  other vias: 12.7,13.97
N$31  (via drill 0.3 pad 0.61)
  other vias: 71.75,57.15
N$35  (via drill 0.3 pad 0.61)
  other vias: 98.42,1.27
N$36  (via drill 0.3 pad 0.61)
  other vias: 21.59,55.88
N$37  (via drill 0.3 pad 0.61)
  other vias: 16.51,55.88
N$38  (via drill 0.3 pad 0.61)
  other vias: 12.7,10.16
N$39  (via drill 0.3 pad 0.61)
  other vias: 93.98,41.91
N$40  (via drill 0.3 pad 0.61)
  other vias: 98.42,16.51
N$41  (via drill 0.3 pad 0.61)
  other vias: 95.25,16.51
N$42  (via drill 0.3 pad 0.61)
  other vias: 98.42,19.68
N$43  (via drill 0.3 pad 0.61)
  other vias: 95.25,19.68
N$44  (via drill 0.3 pad 0.61)
  other vias: 97.79,41.91
N$45
  Bottom 0.457: F1.P$2 89.92,7.11 92.23,4.8 X4.1
N$47
  Bottom 0.305: IC1.6 79.38,20.52 82.37,20.52 82.77,20.13 82.77,15.13 83.84,14.05 Q1.1
N$48
  Bottom 0.305: 83.29,11.4 80.98,11.4 80.64,11.73 IC1.2 | 83.29,11.4 84.34,11.4 84.79,11.85 Q1.3 | 83.29,11.4 83.29,8.13 ZD1.6
N$52
  Bottom 0.305: Q1.2 87.35,14.05 87.35,14.86 87.95,15.46 R4.1
NRESET
  Top 0.305: U$1.34 16.19,34.02 24.72,25.49 43.2,25.49 43.3,25.58 47.83,25.58 53.01,20.41 53.01,20.1 CTX-DB.10
RO-A
  Bottom 0.305: RS485.1 91.54,27.94 92.11,27.37 94.22,27.37 95.89,25.7 U$2.D8
RST
  Bottom 0.305: IC2.3 36.8,47.62 36.8,38.55 37.94,37.41 37.94,26.07 41.59,22.42 U$1.17
RX1
  Bottom 0.305: HMMOD-UART.5 71.01,50.23 70.64,50.6 65.7,50.6 61.45,46.35 59.39,46.35 55.6,42.56 55.6,41.59 54.69,40.67 51.04,40.67 46.67,36.3 U$1.22 46.67,34.92 46.67,34.02 46.67,23.59 47.14,23.12 48.98,23.12 50.29,21.82 50.29,14.17 47.55,11.43 UART1.3
RX-MAPLE  (via drill 0.3 pad 0.61)
  Top 0.305: U$1.30 26.35,34.02 27.62,34.02 v28.82,32.81 31.99,32.81 33.76,31.05 63.45,31.05 66.33,33.92 66.33,34.18 U$2.TX0-1
  Bottom 0.305: UART0.3 36.27,11.43 35.81,11.89 35.81,14 34.74,15.07 29.21,15.07 27.8,16.49 27.8,23.24 28.82,24.27 v28.82,32.81
RX_DBG  (via drill 0.3 pad 0.61)
  Top 0.305: v45.83,23.98 45.69,24.12 43.77,24.12 43.68,24.03 35.58,24.03 33.97,22.42 U$1.14
  Bottom 0.305: v45.83,23.98 45.61,24.2 45.61,37.05 50.47,41.91 51.69,41.91 TX.1 | U$1.14 33.97,18.76 33.97,18.34 37.07,15.24 39.18,15.24 40.64,13.78 DBG.3
SCK1  (via drill 0.3 pad 0.61)
  Top 0.305: U$1.28 31.43,34.02 33.95,31.5 49.45,31.5 v49.64,31.69 59.92,31.69 67.83,39.6 75.8,39.6 77.39,41.2 77.39,48.59 76.45,49.53 CC4.SCLK 74.87,49.21 71.23,49.21 70.92,49.53 CC_X4.4 | CC2.SCLK 26.67,46.24 27.41,46.99 CC_X2.4 | CC1.SCLK 73.66,13.35 71.74,11.43 CC_X1.4 | CC_X0.4 30.68,6.35 30.68,7.1 28.9,8.89 27.2,8.89 26.67,9.41 CC0.SCLK
  Bottom 0.305: CC_X1.4 68.78,11.43 68.78,11.3 67.81,10.32 66.88,10.32 49.64,27.56 v49.64,31.69 | 30.64,38.44 31.43,37.64 U$1.28 | 30.64,38.44 30.64,44.92 31.64,45.92 31.75,45.92 CC_X2.4 | 30.64,38.44 29.2,38.44 27.78,37.02 27.78,32.59 28.09,32.28 28.09,25.89 25.28,23.08 25.28,8.04 27.91,5.4 29.73,5.4 30.68,6.35 CC_X0.4
SCK2
  Bottom 0.305: 40.43,42.55 40.43,34.72 41.14,34 42.78,34 43.85,32.93 43.85,23.25 44.21,22.89 44.37,22.89 U$1.19 | 40.43,42.55 40.31,42.55 IC2.5 | IC2.4 40.43,45.09 40.43,42.55
SCK-A  (via drill 0.3 pad 0.61)
  Top 0.305: v63.96,32.48 66.89,35.41 89.84,35.41 90.81,36.38 U$2.D13
  Bottom 0.305: NRF24L01+.5 v63.96,32.48
SWCLK/TCK
  Top 0.305: CTX-DB.4 52.67,16.29 50.21,18.76 28.42,18.76 27.49,19.7 27.49,21.73 26.8,22.42 23.81,22.42 U$1.10
SWDIO/TMS
  Top 0.305: U$1.11 26.35,18.76 27.67,18.76 28.13,18.3 49.73,18.3 53.01,15.02 CTX-DB.2
SWO/TDO
  Top 0.305: U$1.8 18.73,18.76 21.73,18.76 22.6,19.64 22.6,21.86 25.22,24.48 43.49,24.48 43.61,24.6 47.48,24.6 51.32,20.76 51.32,19.25 53.01,17.56 CTX-DB.6
TDI
  Top 0.305: CTX-DB.8 53.01,18.83 52.16,19.68 52.16,20.58 47.68,25.06 43.42,25.06 43.32,24.96 23.81,24.96 21.27,22.42 U$1.9
TX1  (via drill 0.3 pad 0.61)
  Top 0.305: HMMOD-UART.6 71.01,52.23 71.01,52.43 70.25,53.19 63.19,53.19 61.44,51.44 58.79,51.44 v57.99,50.63
  Bottom 0.305: UART1.2 47.55,13.97 47.75,14.17 47.75,21.78 46.89,22.64 46.27,22.64 45.15,23.76 45.15,33 44.13,34.02 U$1.23 44.13,37.64 45.47,37.64 51.59,43.76 55.41,43.76 57.99,46.34 v57.99,50.63
TX-MAPLE  (via drill 0.3 pad 0.61)
  Top 0.305: U$2.RX1-1 66.33,31.64 65.5,31.64 64.38,30.52 v32.37,30.52 27.31,30.52 23.81,34.02 U$1.31
  Bottom 0.305: v32.37,30.52 32.88,30.02 32.88,17.58 36.27,14.19 36.27,13.97 UART0.2
TX_DBG  (via drill 0.3 pad 0.61)
  Top 0.305: v44.46,23.5 44,23.04 v42.56,23.04 37.13,23.04 36.51,22.42 U$1.15
  Bottom 0.305: v44.46,23.5 44.46,32.97 43.07,34.36 43.07,37.28 43.95,38.16 44.78,38.16 51.69,45.07 51.69,45.09 RX.1 | v42.56,23.04 42.7,22.9 42.7,6.12 43.18,5.64 DBG.2
VCC
  Top 0.457: C10.+ 28.57,12.74 32.34,16.51 36.2,16.51 UART0.1 UART1.1 | CC4.VCC 73.84,55.53 73.54,55.83 C4.2 72.22,55.83 71.26,55.83 70.99,56.1 70.99,57.15 CHPD.1 | 30.41,41.97 28.79,43.58 27.04,43.58 26.91,43.46 24.23,43.46 24.05,43.64 24.05,50.83 24.29,51.06 26.61,51.06 26.75,50.92 36.21,50.92 36.62,51.33 42.39,51.33 42.56,51.16 ESP8266.VCC 44.11,51.16 44.83,51.16 45.82,50.16 57.49,50.16 57.71,49.95 58.34,49.95 58.55,50.16 IC2.11 62.33,50.16 64.24,52.07 66.17,52.07 CC_X4.1 | 30.41,41.97 31.75,43.31 CC_X2.2 32.89,44.45 CC_X2.1 34.29,41.42 34.3,41.41 C5.+ | 30.41,41.97 29.07,40.63 29.07,40.59 C3.2 27.38,40.59 26.81,40.59 26.81,40.31 26.75,40.24 CC2.VCC 8.03,40.24 4.76,36.97 4.76,34.71 4,33.94 0.95,33.94 U$1.40 | CC_X1.1 63.05,13.97 61.99,15.02 CTX-DB.1 59.47,15.02 58.83,15.67 58.83,20.71 58.99,20.86 65.04,20.86 65.96,19.94 C7.2 70.68,19.94 71.26,19.36 C2.2 73.52,19.36 73.54,19.35 CC1.VCC | DBG.1 45.72,5.71 37.34,5.71 35.43,3.81 CC_X0.1 CC_X0.2 30.61,3.81 29.1,2.31 C1.2 26.81,2.31 26.81,3.35 26.75,3.42 CC0.VCC
  Bottom 0.457: 67.31,14.54 68.14,14.54 68.71,13.97 CC_X1.2 70.99,13.97 70.99,13.64 71.93,12.7 3V3.1 | 67.31,14.54 67.31,15.11 64.14,18.29 NRF24L01+.2 63,26.17 63,29.56 64.68,31.24 64.68,37.66 68.58,41.56 68.58,42.28 69.36,43.05 72.45,43.05 HMMOD-UART.1 74.33,42.23 | CC_X1.1 67.31,14.54 | 74.33,42.23 75.55,42.23 78.11,39.68 U$2.VCC | 69.85,53.29 73.68,53.29 74.33,52.65 74.33,42.23 | 69.85,53.29 69.85,55.24 CHPD.1 | 69.85,52.64 69.85,53.29 | IC2.10 58.55,47.62 58.55,50.16 59.34,50.16 | C11.2 57.15,51.99 57.68,51.99 59.34,50.33 59.34,50.16 | IC2.11 59.34,50.16 | DBG.1 45.72,5.71 43.81,7.62 43.81,16.51 UART1.1 | CC_X2.1 34.29,43.31 35.38,42.22 35.38,24.49 37.78,22.08 37.78,16.83 UART0.1 | 69.85,52.64 69.03,52.64 68.45,52.07 CC_X4.1 | CC_X4.2 69.85,52.64 | C6.1 1.59,33.88 1.01,33.88 0.95,33.94 U$1.40
VDD  (via drill 0.3 pad 0.61)
  Top 0.457: X7.1 77.94,7.56 v82.73,12.36
  Bottom 0.457: X7.1 77.5,2.64 69.4,2.64 68.71,3.34 68.71,6.84 69.57,7.71 74.42,7.71 5V.1 3V3.2 | C9.2 91.76,32.52 93.8,30.48 93.8,27.94 RS485.8 96.92,26.19 96.92,21.63 94.34,19.05 90.88,19.05 R1.1 89.85,17.92 | 89.85,17.92 85.76,17.92 84.95,18.73 R2.1 | 89.85,17.92 89.85,17.64 R4.2 89.8,16.46 89.8,14.34 89.92,14.22 F1.P$1 87.89,12.83 87.78,12.94 83.31,12.94 v82.73,12.36 | v82.73,12.36 | IC1.1 82.61,12.36 v82.73,12.36
WIZ_RST  (via drill 0.3 pad 0.61)
  Top 0.305: v47.39,23.73 46.08,22.42 39.05,22.42 U$1.16
  Bottom 0.305: v47.39,23.73 47.39,34.13 47.78,34.52 47.78,36.73 49.69,38.64 54.73,38.64 58.63,42.55 IC2.8

### Text on the board
tNames: GND | LAN | CS | ESP-03 | VCC | MOSI | SCK | MISO | IN | VCC | CS | GND | VCC | GND | 5V | MAPLE CUN large version A 1.3 | www.neuby.de | 31 (PB12) | + | TX | RX | GND | GND | + | RX | TX | VCC
bNames: ESP->MAPLE | MAPLE CUN Lage Version A 1.3 | VDD | GND | VDD | GND